# EAGLE schematic External Diagram v2 (EAGLE 8.2.1)
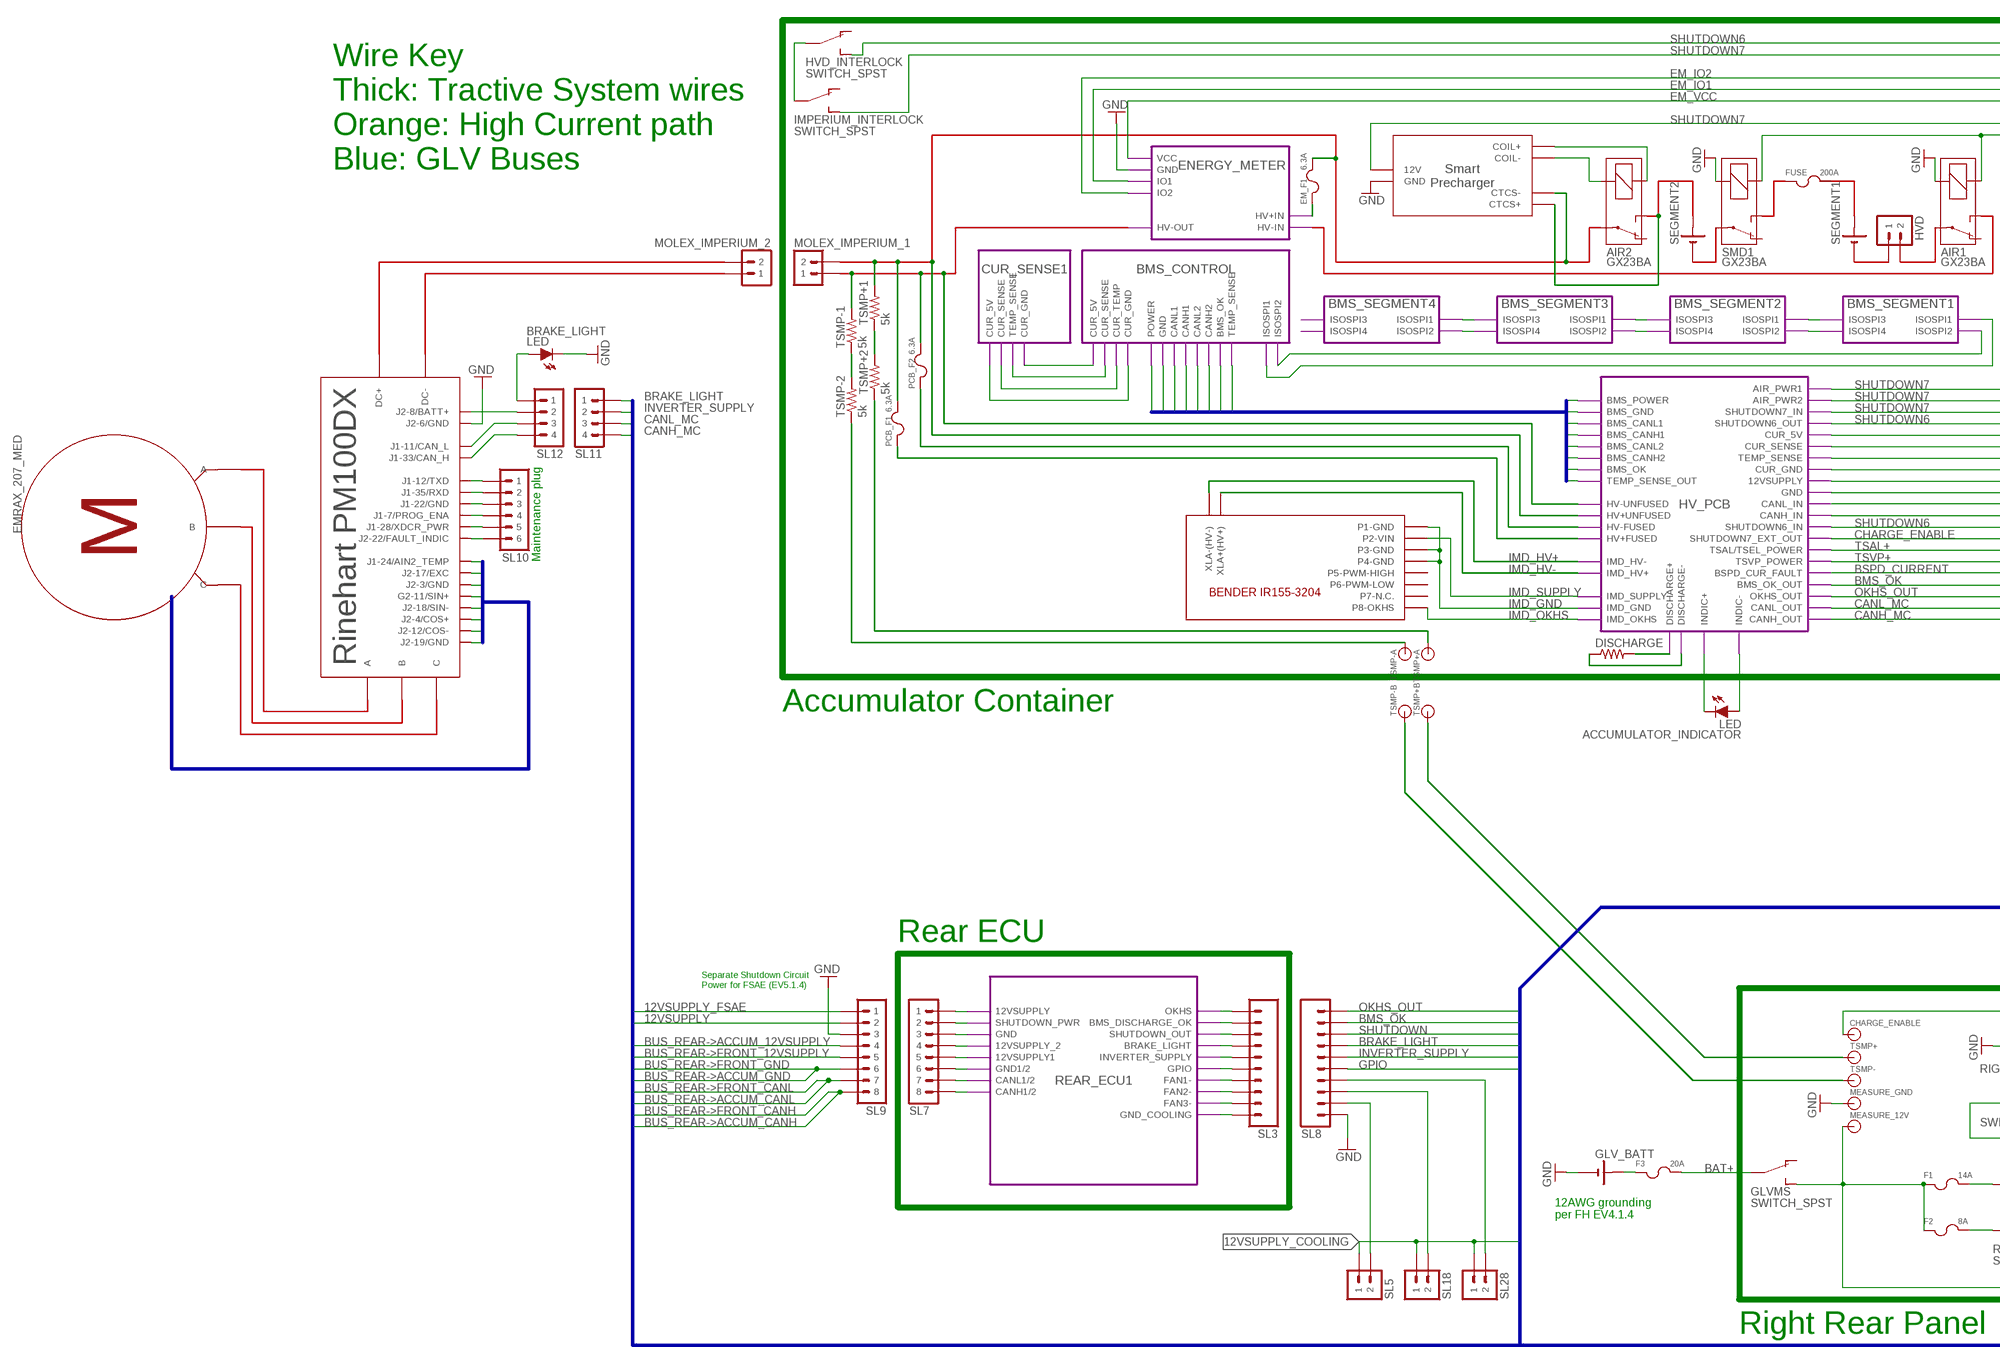
[diagram p0: schematic, sheet 1, part 1 of 2]
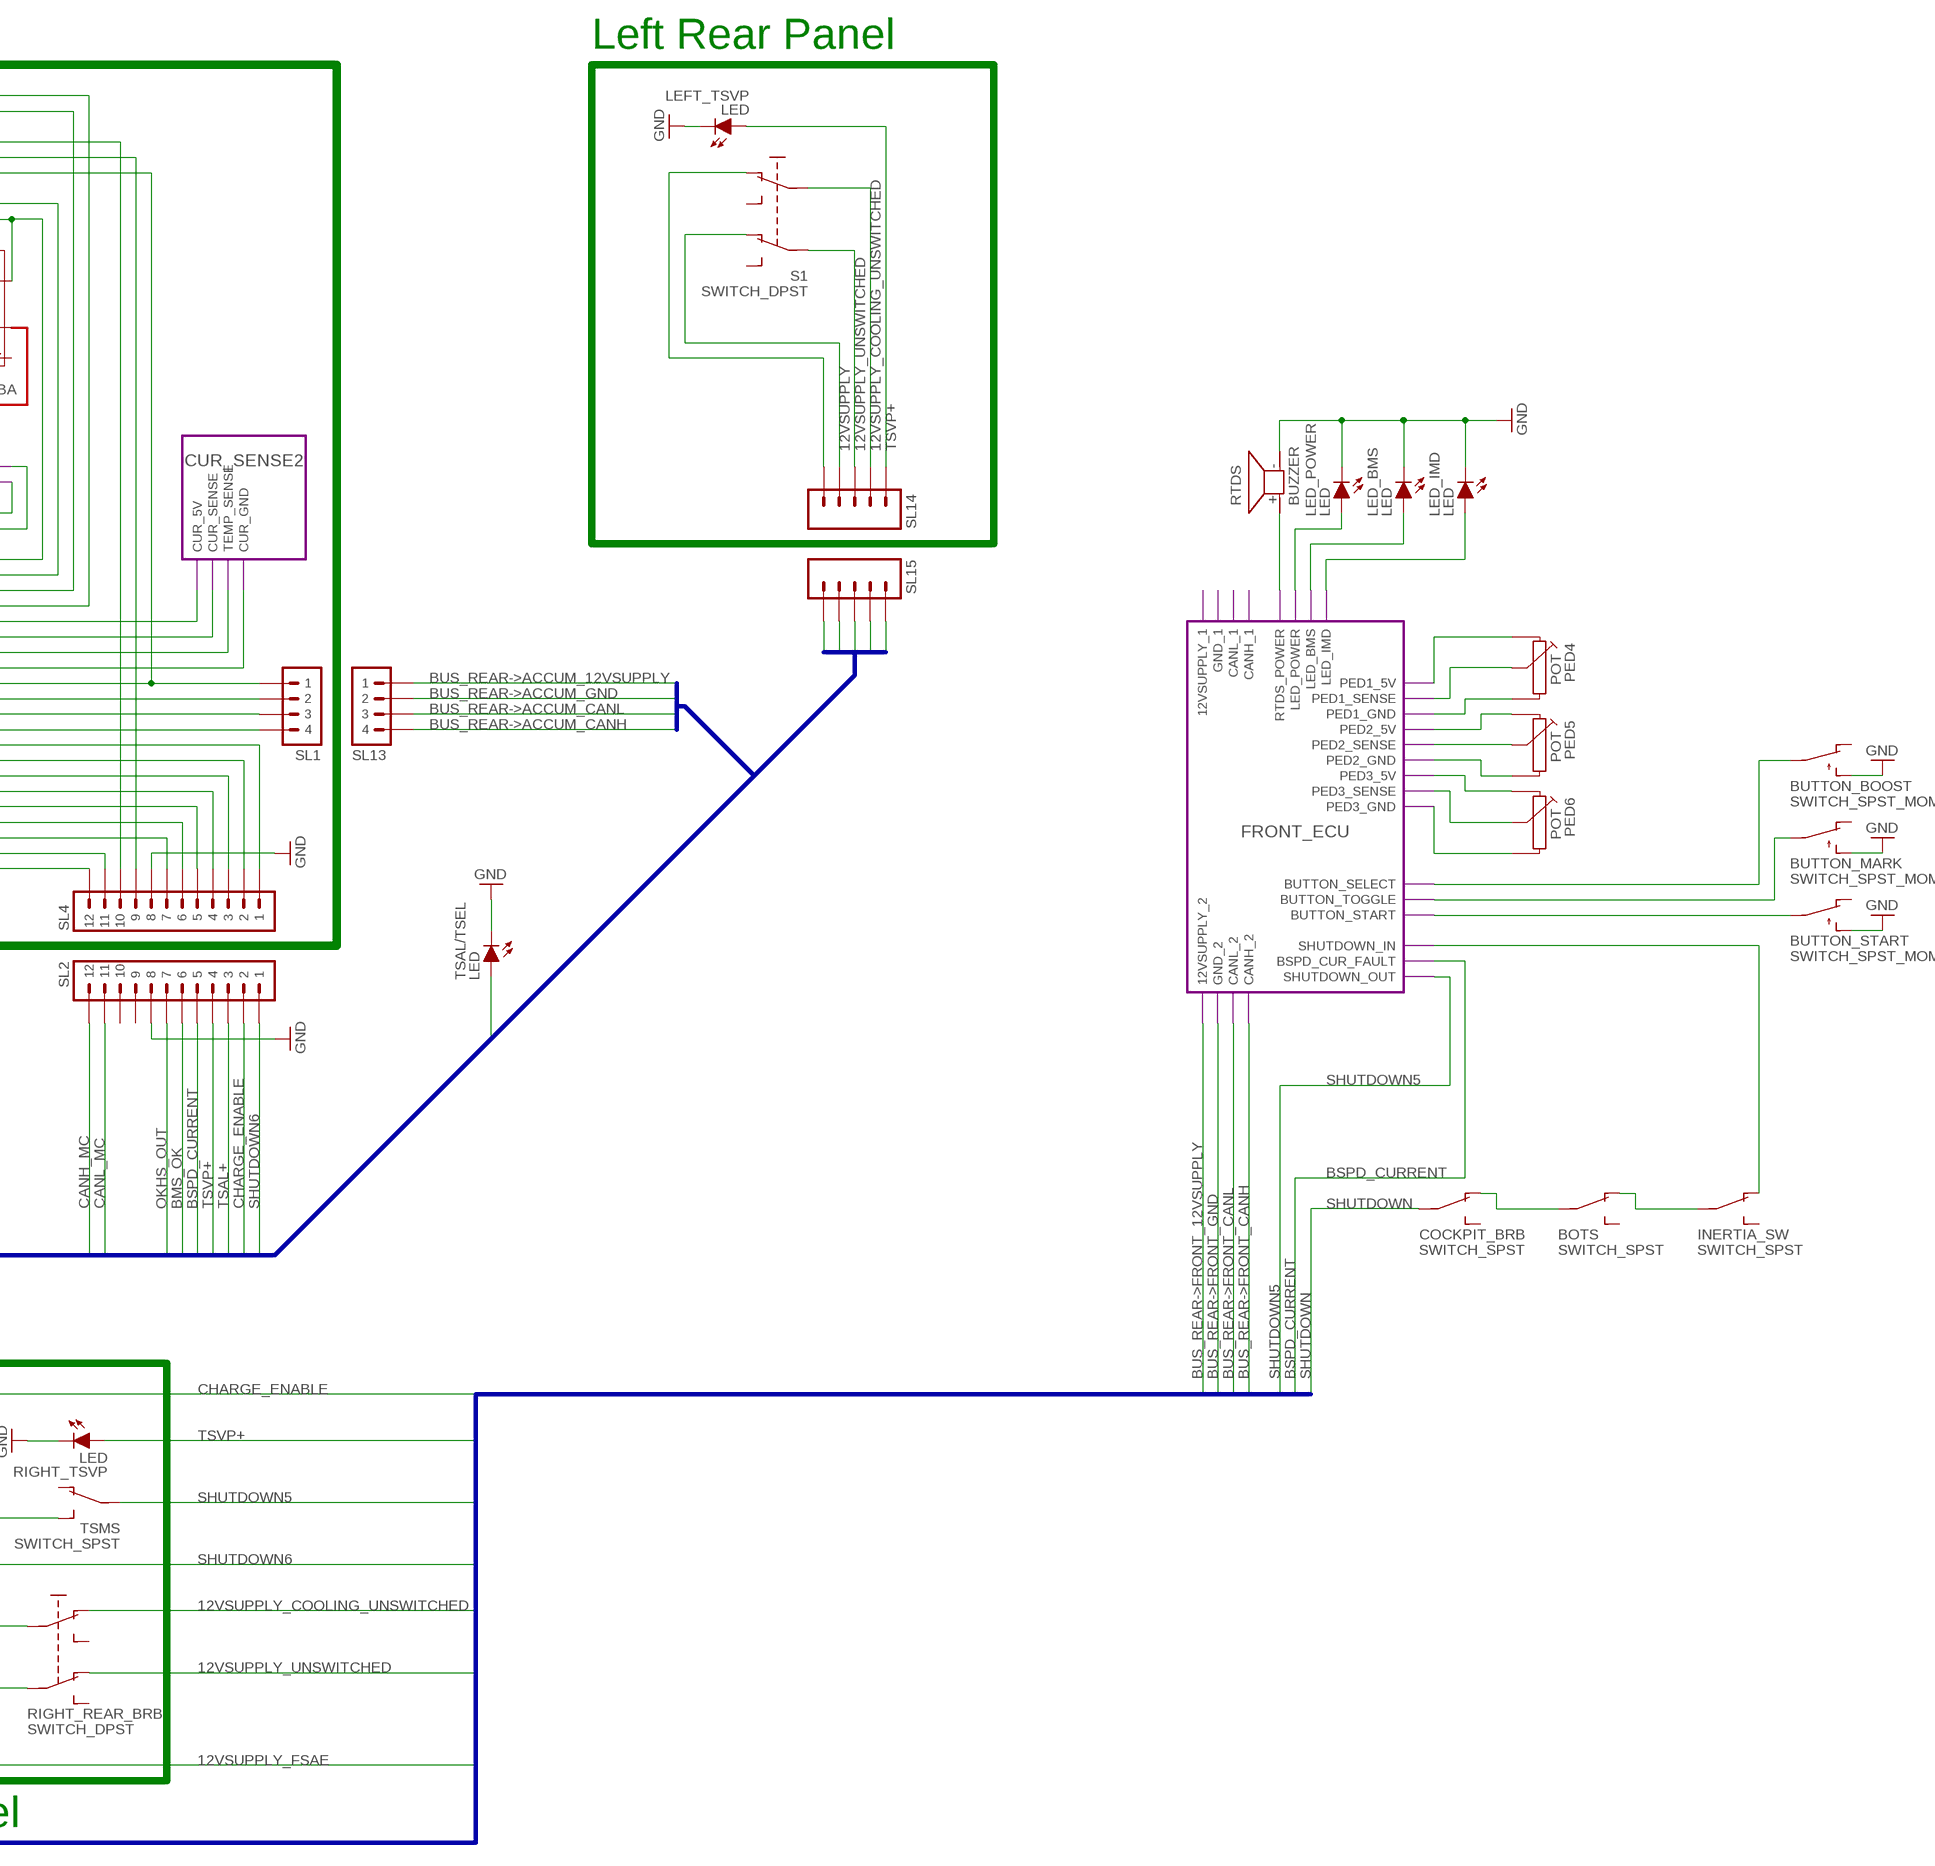
[diagram p1: schematic, sheet 1, part 2 of 2]

## Parts
ACCUMULATOR_INDICATOR  LED  (no package)
AIR1  GX23BA  RELAY  (no package)
AIR2  GX23BA  RELAY  (no package)
BOTS  SWITCH_SPST  (no package)
BRAKE_LIGHT  LED  (no package)
BUTTON_BOOST  SWITCH_SPST_MOM  (no package)
BUTTON_MARK  SWITCH_SPST_MOM  (no package)
BUTTON_START  SWITCH_SPST_MOM  (no package)
CHARGE_ENABLE  BANANA_JACK  (no package)
COCKPIT_BRB  SWITCH_SPST  (no package)
DISCHARGE  RESISTOR10W  [10W_RESISTOR_VISHAY]
EM_F1  6.3A  FUSE  (no package)
EMRAX_207_MED  MOTOR_AC  (no package)
F1  14A  FUSE  (no package)
F2  8A  FUSE  (no package)
F3  20A  FUSE  (no package)
FUSE  200A  FUSE  (no package)
GLV_BATT  BATTERY_1_CELL  (no package)
GLVMS  SWITCH_SPST  (no package)
HVD  M02  (no package)
HVD_INTERLOCK  SWITCH_SPST  (no package)
IMPERIUM_INTERLOCK  SWITCH_SPST  (no package)
INERTIA_SW  SWITCH_SPST  (no package)
LED_BMS  LED  (no package)
LED_IMD  LED  (no package)
LED_POWER  LED  (no package)
LEFT_TSVP  LED  (no package)
MEASURE_12V  BANANA_JACK  (no package)
MEASURE_GND  BANANA_JACK  (no package)
MOLEX_IMPERIUM_1  M02  (no package)
MOLEX_IMPERIUM_2  M02  (no package)
PCB_F1  6.3A  FUSE  (no package)
PCB_F2  6.3A  FUSE  (no package)
PED4  POTENTIOMETER  (no package)
PED5  POTENTIOMETER  (no package)
PED6  POTENTIOMETER  (no package)
RIGHT_REAR_BRB  SWITCH_DPST  (no package)
RIGHT_TSVP  LED  (no package)
RTDS  BUZZER  (no package)
S1  SWITCH_DPST  (no package)
SEGMENT1  BATTERY_1_CELL  (no package)
SEGMENT2  BATTERY_1_CELL  (no package)
SL1  M04  (no package)
SL2  M12  (no package)
SL3  M10  (no package)
SL4  M12  (no package)
SL5  M02  (no package)
SL7  M08  (no package)
SL8  M10  (no package)
SL9  M08  (no package)
SL10  M06  (no package)
SL11  M04  (no package)
SL12  M04  (no package)
SL13  M04  (no package)
SL14  M05  (no package)
SL15  M05  (no package)
SL18  M02  (no package)
SL28  M02  (no package)
SMD1  GX23BA  RELAY  (no package)
TSAL/TSEL  LED  (no package)
TSMP+  BANANA_JACK  (no package)
TSMP+1  5k  RESISTOR10W  [10W_RESISTOR_VISHAY]
TSMP+2  5k  RESISTOR10W  [10W_RESISTOR_VISHAY]
TSMP+A  BANANA_JACK  (no package)
TSMP+B  BANANA_JACK  (no package)
TSMP-  BANANA_JACK  (no package)
TSMP-1  5k  RESISTOR10W  [10W_RESISTOR_VISHAY]
TSMP-2  5k  RESISTOR10W  [10W_RESISTOR_VISHAY]
TSMP-A  BANANA_JACK  (no package)
TSMP-B  BANANA_JACK  (no package)
TSMS  SWITCH_SPST  (no package)
U$1  RINEHART_PM100DX  (no package)
U$2  BENDER_IR155-3204  (no package)
U$3  SMART_PRECHARGER  (no package)

## Module instances
FRONT_ECU = DASHBOARD_BOARD
HV_PCB = HV_BOARD
BMS_SEGMENT1 = BMS_SEGMENT
BMS_SEGMENT2 = BMS_SEGMENT
BMS_SEGMENT3 = BMS_SEGMENT
BMS_SEGMENT4 = BMS_SEGMENT
BMS_CONTROL = BMS_CONTROL
ENERGY_METER = ENERGY_METER
REAR_ECU1 = REAR_ECU
CUR_SENSE1 = CUR_SENSE
CUR_SENSE2 = CUR_SENSE

## Nets
12VSUPPLY: S1.O1 SL9.2 SL14.2 SL15.2
12VSUPPLY_COOLING: SL5.1 SL15.1 SL18.1 SL28.1
12VSUPPLY_COOLING_UNSWITCHED: RIGHT_REAR_BRB.O S1.P SL14.4 SL15.4
12VSUPPLY_FSAE: F1.1 F2.1 GLVMS.S MEASURE_12V.1 SL9.1
12VSUPPLY_UNSWITCHED: RIGHT_REAR_BRB.O1 S1.P1 SL14.3 SL15.3
BAT+: F3.2 GLVMS.P
BMS_CANH1: port BMS_CONTROL.CANH1 HV_PCB.BMS_CANH1
BMS_CANH2: port BMS_CONTROL.CANH2 HV_PCB.BMS_CANH2
BMS_CANL1: port BMS_CONTROL.CANL1 HV_PCB.BMS_CANL1
BMS_CANL2: port BMS_CONTROL.CANL2 HV_PCB.BMS_CANL2
BMS_GND: port BMS_CONTROL.GND HV_PCB.BMS_GND
BMS_OK: SL2.6 SL4.6 SL8.2 ; port BMS_CONTROL.BMS_OK HV_PCB.BMS_OK HV_PCB.BMS_OK_OUT
BMS_POWER: port BMS_CONTROL.POWER HV_PCB.BMS_POWER
BRAKE_LIGHT: SL8.4 SL11.1
BSPD_CURRENT: SL2.5 SL4.5 ; port FRONT_ECU.BSPD_CUR_FAULT HV_PCB.BSPD_CUR_FAULT
BUS_REAR->ACCUM_12VSUPPLY: SL9.4 SL13.1
BUS_REAR->ACCUM_CANH: SL13.4
BUS_REAR->ACCUM_CANL: SL13.3
BUS_REAR->ACCUM_GND: SL13.2
BUS_REAR->FRONT_12VSUPPLY: SL9.5 ; port FRONT_ECU.12VSUPPLY_2
BUS_REAR->FRONT_CANH: SL9.8 ; port FRONT_ECU.CANH_2
BUS_REAR->FRONT_CANL: SL9.7 ; port FRONT_ECU.CANL_2
BUS_REAR->FRONT_GND: SL9.6 ; port FRONT_ECU.GND_2
CANH_MC: SL2.12 SL4.12 SL11.4 ; port HV_PCB.CANH_OUT
CANH_OUT: SL12.3 U$1.J1-11/CAN_L
CANL_MC: SL2.11 SL4.11 SL11.3 ; port HV_PCB.CANL_OUT
CANL_OUT: SL12.4 U$1.J1-33/CAN_H
CHARGE_ENABLE: CHARGE_ENABLE.1 SL2.2 SL4.2 ; port HV_PCB.SHUTDOWN7_EXT_OUT
COS+: U$1.J2-4/COS+
COS-: U$1.J2-12/COS-
EM_IO1: SL4.9 ; port ENERGY_METER.IO1
EM_IO2: SL4.10 ; port ENERGY_METER.IO2
EM_VCC: SL1.1 ; port ENERGY_METER.VCC HV_PCB.12VSUPPLY
EXC+: U$1.J2-17/EXC
EXC-: U$1.J2-3/GND
GND: AIR1.2 BRAKE_LIGHT.C BUTTON_BOOST.S BUTTON_MARK.S BUTTON_START.S GLV_BATT.- LED_BMS.C LED_IMD.C LED_POWER.C LEFT_TSVP.C MEASURE_GND.1 RIGHT_TSVP.C RTDS.2 SL2.8 SL4.8 SL8.10 SL9.3 SMD1.2 TSAL/TSEL.C U$1.J2-6/GND U$1.J2-19/GND U$3.GND ; port ENERGY_METER.GND
GPIO: SL8.6
IMD_GND: U$2.P1-GND U$2.P3-GND U$2.P4-GND ; port HV_PCB.IMD_GND
IMD_HV+: U$2.XLA-(HV-) ; port HV_PCB.IMD_HV-
IMD_HV-: U$2.XLA+(HV+) ; port HV_PCB.IMD_HV+
IMD_OKHS: U$2.P8-OKHS ; port HV_PCB.IMD_OKHS
IMD_SUPPLY: U$2.P2-VIN ; port HV_PCB.IMD_SUPPLY
INVERTER_SUPPLY: SL8.5 SL11.2 SL12.2 U$1.J2-8/BATT+
MOTOR_TEMP: U$1.J1-24/AIN2_TEMP
N$1: RTDS.1 ; port FRONT_ECU.RTDS_POWER
N$2: LED_POWER.A ; port FRONT_ECU.LED_POWER
N$3: TSMP-.1 TSMP-B.1
N$4: BRAKE_LIGHT.A SL12.1
N$5: EM_F1.1 ; port ENERGY_METER.HV+IN
N$6: EM_F1.2
N$7: port BMS_CONTROL.CUR_GND CUR_SENSE1.CUR_5V
N$8: S1.O SL14.1
N$9: port BMS_CONTROL.CUR_TEMP CUR_SENSE1.CUR_SENSE
N$10: port BMS_CONTROL.CUR_SENSE CUR_SENSE1.TEMP_SENSE
N$11: port BMS_CONTROL.CUR_5V CUR_SENSE1.CUR_GND
N$12: port HV_PCB.HV+UNFUSED
N$15: TSMP+.1 TSMP+B.1
N$16: F1.2 RIGHT_REAR_BRB.P
N$17: F2.2 RIGHT_REAR_BRB.P1
N$18: port HV_PCB.HV-UNFUSED
N$19: SL3.1 ; port REAR_ECU1.OKHS
N$20: TSMP-2.1 TSMP-A.1
N$21: SL3.2 ; port REAR_ECU1.BMS_DISCHARGE_OK
N$22: ACCUMULATOR_INDICATOR.A ; port HV_PCB.INDIC-
N$23: SL3.3 ; port REAR_ECU1.SHUTDOWN_OUT
N$24: DISCHARGE.1 ; port HV_PCB.DISCHARGE-
N$25: DISCHARGE.2 ; port HV_PCB.DISCHARGE+
N$26: PED4.1A ; port FRONT_ECU.PED1_5V
N$27: SL3.4 ; port REAR_ECU1.BRAKE_LIGHT
N$28: SL3.5 ; port REAR_ECU1.INVERTER_SUPPLY
N$29: SL3.6 ; port REAR_ECU1.GPIO
N$30: SL3.7 ; port REAR_ECU1.FAN1-
N$31: SL3.8 ; port REAR_ECU1.FAN2-
N$32: SL10.1 U$1.J1-12/TXD
N$34: TSMP+2.1 TSMP+A.1
N$35: SL3.9 ; port REAR_ECU1.FAN3-
N$36: SL3.10 ; port REAR_ECU1.GND_COOLING
N$37: TSMP-1.1 TSMP-2.2
N$38: TSMP+1.1 TSMP+2.2
N$39: TSMP-1.2
N$40: TSMP+1.2
N$41: SL7.1 ; port REAR_ECU1.12VSUPPLY
N$42: U$3.CTCS-
N$43: SL10.2 U$1.J1-35/RXD
N$44: port BMS_SEGMENT3.ISOSPI3 BMS_SEGMENT4.ISOSPI1
N$45: AIR2.2 U$3.COIL-
N$46: PCB_F1.1 ; port HV_PCB.HV+FUSED
N$47: BUTTON_START.P ; port FRONT_ECU.BUTTON_START
N$48: BUTTON_MARK.P ; port FRONT_ECU.BUTTON_TOGGLE
N$49: PCB_F2.1 ; port HV_PCB.HV-FUSED
N$50: BUTTON_BOOST.P ; port FRONT_ECU.BUTTON_SELECT
N$51: PCB_F1.2
N$52: PCB_F2.2
N$53: port BMS_SEGMENT3.ISOSPI4 BMS_SEGMENT4.ISOSPI2
N$54: AIR2.1 U$3.COIL+
N$55: port BMS_SEGMENT2.ISOSPI3 BMS_SEGMENT3.ISOSPI1
N$56: port BMS_SEGMENT2.ISOSPI4 BMS_SEGMENT3.ISOSPI2
N$57: port BMS_SEGMENT1.ISOSPI3 BMS_SEGMENT2.ISOSPI1
N$58: port BMS_SEGMENT1.ISOSPI4 BMS_SEGMENT2.ISOSPI2
N$60: U$3.CTCS+
N$61: HVD_INTERLOCK.P IMPERIUM_INTERLOCK.P
N$63: SL10.3 U$1.J1-22/GND
N$64: SL7.2 ; port REAR_ECU1.SHUTDOWN_PWR
N$65: SL7.3 ; port REAR_ECU1.GND
N$66: SL7.4 ; port REAR_ECU1.12VSUPPLY_2
N$67: ACCUMULATOR_INDICATOR.C ; port HV_PCB.INDIC+
N$68: F3.1 GLV_BATT.+
N$69: SL10.4 U$1.J1-7/PROG_ENA
N$70: port BMS_SEGMENT1.ISOSPI2 BMS_CONTROL.ISOSPI2
N$71: SL10.5 U$1.J1-28/XDCR_PWR
N$72: SL10.6 U$1.J2-22/FAULT_INDIC
N$73: SL7.5 ; port REAR_ECU1.12VSUPPLY1
N$74: port BMS_SEGMENT1.ISOSPI1 BMS_CONTROL.ISOSPI1
N$75: LED_BMS.A ; port FRONT_ECU.LED_BMS
N$76: SL7.6 ; port REAR_ECU1.GND1/2
N$77: SL7.7 ; port REAR_ECU1.CANL1/2
N$78: SL7.8 ; port REAR_ECU1.CANH1/2
N$79: SL5.2 SL8.9
N$80: SL1.2 ; port HV_PCB.GND
N$81: SL1.3 ; port HV_PCB.CANL_IN
N$82: SL1.4 ; port HV_PCB.CANH_IN
N$83: PED4.1S ; port FRONT_ECU.PED1_SENSE
N$84: PED4.1E ; port FRONT_ECU.PED1_GND
N$86: PED5.1A ; port FRONT_ECU.PED2_5V
N$87: PED5.1S ; port FRONT_ECU.PED2_SENSE
N$88: PED5.1E ; port FRONT_ECU.PED2_GND
N$89: PED6.1A ; port FRONT_ECU.PED3_5V
N$90: PED6.1S ; port FRONT_ECU.PED3_SENSE
N$91: LED_IMD.A ; port FRONT_ECU.LED_IMD
N$93: PED6.1E ; port FRONT_ECU.PED3_GND
N$94: SL8.8 SL18.2
N$95: SL8.7 SL28.2
N$96: port HV_PCB.CUR_GND CUR_SENSE2.CUR_GND
N$97: port HV_PCB.TEMP_SENSE CUR_SENSE2.TEMP_SENSE
N$98: port HV_PCB.CUR_SENSE CUR_SENSE2.CUR_SENSE
N$99: port HV_PCB.CUR_5V CUR_SENSE2.CUR_5V
OKHS_OUT: SL2.7 SL4.7 SL8.1 ; port HV_PCB.OKHS_OUT
SHUTDOWN: COCKPIT_BRB.P SL8.3
SHUTDOWN2: BOTS.P COCKPIT_BRB.O
SHUTDOWN3: BOTS.O INERTIA_SW.P
SHUTDOWN4: INERTIA_SW.O ; port FRONT_ECU.SHUTDOWN_IN
SHUTDOWN5: TSMS.P ; port FRONT_ECU.SHUTDOWN_OUT
SHUTDOWN6: HVD_INTERLOCK.S SL2.1 SL4.1 TSMS.S ; port HV_PCB.SHUTDOWN6_OUT HV_PCB.SHUTDOWN6_IN
SHUTDOWN7: AIR1.1 IMPERIUM_INTERLOCK.S SMD1.1 U$3.12V ; port HV_PCB.SHUTDOWN7_IN HV_PCB.AIR_PWR2 HV_PCB.AIR_PWR1
SIN+: U$1.G2-11/SIN+
SIN-: U$1.J2-18/SIN-
TEMP_SENSE: port HV_PCB.TEMP_SENSE_OUT BMS_CONTROL.TEMP_SENSE
TSAL+: SL2.3 SL4.3 TSAL/TSEL.A ; port HV_PCB.TSAL/TSEL_POWER
TSVP+: LEFT_TSVP.A RIGHT_TSVP.A SL2.4 SL4.4 SL14.5 SL15.5 ; port HV_PCB.TSVP_POWER
Unconnected: AIR1.O AIR1.P AIR1.S AIR2.O AIR2.P AIR2.S BOTS.S BUTTON_BOOST.O BUTTON_MARK.O BUTTON_START.O COCKPIT_BRB.S EMRAX_207_MED.A EMRAX_207_MED.B EMRAX_207_MED.C FUSE.1 FUSE.2 GLVMS.O HVD.1 HVD.2 HVD_INTERLOCK.O IMPERIUM_INTERLOCK.O INERTIA_SW.S MOLEX_IMPERIUM_1.1 MOLEX_IMPERIUM_1.2 MOLEX_IMPERIUM_2.1 MOLEX_IMPERIUM_2.2 RIGHT_REAR_BRB.S RIGHT_REAR_BRB.S1 S1.S S1.S1 SEGMENT1.+ SEGMENT1.- SEGMENT2.+ SEGMENT2.- SL2.9 SL2.10 SMD1.O SMD1.P SMD1.S TSMS.O U$1.A U$1.B U$1.C U$1.DC+ U$1.DC- U$2.P5-PWM-HIGH U$2.P6-PWM-LOW U$2.P7-N.C.

## Buses
MOTOR_TEMP,EXC+,EXC-,SIN+,SIN-,COS+,COS-,GND
12VSUPPLY,12VSUPPLY_COOLING,12VSUPPLY_COOLING_UNSWITCHED,12VSUPPLY_UNSWITCHED,12VSUPPLY_FSAE,BAT+,BRAKE_LIGHT,BSPD_CURRENT,BMS_OK,BUS_REAR->ACCUM_12VSUPPLY,BUS_REAR->ACCUM_CANL,BUS_REAR->ACCUM_CANH,BUS_REAR->ACCUM_GND,BUS_REAR->FRONT_12VSUPPLY,BUS_REAR->FRONT_CANL,BUS_REAR->FRONT_CANH,BUS_REAR->FRONT_GND,CANL_MC,CANH_MC,CHARGE_ENABLE,GPIO,INVERTER_SUPPLY,OKHS_OUT,SHUTDOWN1,SHUTDOWN5,SHUTDOWN6,TSAL+,TSVP+
BMS_POWER,BMS_GND,BMS_CANL1,BMS_CANH1,BMS_CANL2,BMS_CANH2,BMS_OK,TEMP_SENSE

## Notes on the sheet
- Left Rear Panel
- Wire Key
  Thick: Tractive System wires
  Orange: High Current path
  Blue: GLV Buses
- Maintenance plug
- Accumulator Container
- Rear ECU
- Separate Shutdown Circuit
  Power for FSAE (EV5.1.4)
- 12AWG grounding
  per FH EV4.1.4
- Right Rear Panel

## Library data of the parts
ACCUMULATOR_INDICATOR BRAKE_LIGHT LED_BMS LED_IMD LED_POWER LEFT_TSVP RIGHT_TSVP TSAL/TSEL = HyTechSymbols:LED: Generic LED
AIR1 AIR2 SMD1 = HyTechSymbols:RELAY: RELAY 1 x switch
BOTS COCKPIT_BRB GLVMS HVD_INTERLOCK IMPERIUM_INTERLOCK INERTIA_SW TSMS = HyTechSymbols:SWITCH_SPST: Single Pull Single Throw Switch
BUTTON_BOOST BUTTON_MARK BUTTON_START = HyTechSymbols:SWITCH_SPST_MOM: Single Pull Single Throw Switch Momentary
CHARGE_ENABLE MEASURE_12V MEASURE_GND TSMP+ TSMP+A TSMP+B TSMP- TSMP-A TSMP-B = HyTechSymbols:BANANA_JACK: Banana Jack Purchasing: Mouser - Red <http://www.mouser.com/ProductDetail/Pomona-Electronics/72930-2/?qs=2nDnb8a6ouM2t6dPw1JBow%3D%3D> Mouser - Black <http://www.mouser.com/ProductDetail/Pomona-Electronics/72930-0/?qs=2nDnb8a6ouNpA2wl9kKnzA%3D%3D>
DISCHARGE TSMP+1 TSMP+2 TSMP-1 TSMP-2 = HyTechDevices:RESISTOR: Resistor Basic schematic elements and footprints for 0603, 1206, and PTH resistors.
EM_F1 F1-F3 FUSE PCB_F1 PCB_F2 = HyTechSymbols:FUSE: Generic Fuse
EMRAX_207_MED = HyTechSymbols:MOTOR_AC: Generic three-phase AC electric motor
GLV_BATT SEGMENT1 SEGMENT2 = HyTechSymbols:BATTERY_1_CELL: Generic 1-cell battery Source: Sonnenschein
HVD MOLEX_IMPERIUM_1 MOLEX_IMPERIUM_2 SL5 SL18 SL28 = HyTechSymbols:M02: Generic 2-pin connector
PED4-PED6 = HyTechSymbols:POTENTIOMETER: Generic potentiometer
RIGHT_REAR_BRB S1 = HyTechSymbols:SWITCH_DPST: Double Pull Single Throw Switch
RTDS = HyTechSymbols:BUZZER: SPEAKER Prouct Page <http://www.alliedelec.com/icc-intervox-brp4535s-12-c/70115826/> (Ready to Drive Sound) Source: Schukat
SL1 SL11-SL13 = HyTechSymbols:M04: Generic 4-pin connector
SL2 SL4 = HyTechSymbols:M12: Generic 12-pin connector
SL3 SL8 = HyTechSymbols:M10: Generic 10-pin connector
SL7 SL9 = HyTechSymbols:M08: Generic 8-pin connector
SL10 = HyTechSymbols:M06: Generic 6-pin connector
SL14 SL15 = HyTechSymbols:M05: Generic 5-pin connector
U$1 = HyTechSymbols:RINEHART_PM100DX: Rinehart Motion Systems PM100DX Motor Inverter Product Page <http://www.rinehartmotion.com/standard.html> Datasheet <http://www.rinehartmotion.com/uploads/5/1/3/0/51309945/pm100-150datasheet_2.pdf>
U$2 = HyTechSymbols:BENDER_IR155-3204: Bender IR155-3204 Insulation Monitoring Device Datasheet <http://www.bender-es.com/fileadmin/products/doc/IR155-32xx-V004_D00115_D_XXEN.pdf>
U$3 = HyTechSymbols:SMART_PRECHARGER: Smart Precharger http://www.zeva.com.au/Products/datasheets/SmartPrechargerV1-3.pdf

## Module PEDAL_BOX_BOARD
Ports: 12VSUPPLY_1(in) CANL_1(io) CANH_1(io) CANH_2(io) CANL_2(io) 12VSUPPLY_2(out) SHUTDOWN_OUT(out) SHUTDOWN_IN(in) PED1_5V(out) PED2_5V(out) PED3_5V(out) PED1_SENSE(in) PED1_GND(in) PED2_SENSE(in) PED2_GND(in) PED3_SENSE(in) PED3_GND(in) GND_1(out) GND_2(in) BSPD_CUR_FAULT(in)

### Library data of the parts

## Module WHEEL_TELEMETRY_BOARD
Ports: 12VSUPPLY_1(in) GND_2(in) 12VSUPPLY_2(out) GND_1(out) CANL_2(io) CANH_2(io) CANL_1(io) CANH_1(io) WHEEL_SPEED_5V(out) WHEEL_TEMP_5V(out) WHEEL_SPEED_SENSE(in) WHEEL_SPEED_GND(in) WHEEL_TEMP_SENSE(in) WHEEL_TEMP_GND(in) SUSPENSION_GND(in) SUSPENSION_5V(out) SUSPENSION_SENSE(in)

### Library data of the parts

## Module DASHBOARD_BOARD
Ports: CANL_1(io) CANL_2(io) CANH_2(io) CANH_1(io) RTDS_POWER(out) BUTTON_START(in) BUTTON_TOGGLE(in) BUTTON_SELECT(in) GND_1(in) 12VSUPPLY_1(out) GND_2(out) 12VSUPPLY_2(in) LED_POWER(out) LED_BMS(out) LED_IMD(out) PED1_5V(out) PED2_5V(out) PED3_5V(out) PED1_SENSE(in) PED2_SENSE(in) PED3_SENSE(in) PED1_GND(in) PED2_GND(in) PED3_GND(in) SHUTDOWN_IN(in) BSPD_CUR_FAULT(in) SHUTDOWN_OUT(out)

### Library data of the parts

## Module POWER_BOARD
Ports: SHUTDOWN_OUT(out) BRAKE_LIGHT(out) GND_2(in) 12VSUPPLY_2(out) 12VSUPPLY_1(out) GND_1(in) CANH_1(io) CANL_1(io) CANL_2(io) CANH_2(io) 12VSUPPLY(in) OKHS(in) GND(out) INVERTER_SUPPLY(out) GPIO1(io) BMS_DISCHARGE_OK(in) SHUTDOWN_PWR(in) GND2(out)

### Library data of the parts

## Module COOLING_BOARD
Ports: 12VSUPPLY_1(in) GND_1(out) 12VSUPPLY_2(out) GND_2(in) CANL_1(io) CANH_1(io) CANL_2(io) CANH_2(io) FLOW_METER_5V(out) FLOW_METER_SENSE(in) FLOW_METER_GND(in) FAN1-(in) FAN2-(in) PUMP-(in) FAN1_GND(out) FAN2_GND(out) PUMP_GND(out)

### Library data of the parts

## Module HV_BOARD
Ports: TSVP_POWER(out) GND(in) TSAL/TSEL_POWER(out) CUR_SENSE(in) CUR_GND(in) CUR_5V(out) BSPD_CUR_FAULT(out) IMD_SUPPLY(out) IMD_GND(in) IMD_HV+(nc) IMD_HV-(nc) BMS_POWER(out) BMS_GND(in) BMS_OK(in) BMS_CANH2(io) BMS_CANL2(io) BMS_CANL1(io) BMS_CANH1(io) HV+UNFUSED(in) HV-UNFUSED(out) 12VSUPPLY(in) CANH_IN(io) CANL_IN(io) CANH_OUT(io) CANL_OUT(io) BMS_OK_OUT(out) HV+FUSED(in) HV-FUSED(out) AIR_PWR1(out) AIR_PWR2(out) SHUTDOWN6_IN(in) SHUTDOWN6_OUT(out) SHUTDOWN7_IN(in) IMD_OKHS(in) OKHS_OUT(out) SHUTDOWN7_EXT_OUT(out) TEMP_SENSE(in) TEMP_SENSE_OUT(out) INDIC+(out) INDIC-(in) DISCHARGE+(out) DISCHARGE-(in)

### Library data of the parts

## Module SAMSUNG_GALAXY
Ports: 

### Library data of the parts

## Module CUTOFF
Ports: OUT(out) GND(out) IN(in)

### Library data of the parts

## Module RASPBERRY_PI
Ports: 5V(in) GND(out) SI(io) SO(io) SCK(io) CS(io)

### Library data of the parts

## Module STEERING_WHEEL_BOARD
Ports: CANL(io) CANH(io) 12VSUPPLY(in) GND(out) PI_5VSUPPLY(out) PI_GND(in) PI_SI(io) PI_SO(io) PI_SCK(io) PI_CS(io) BUTTON_MAR(in) BUTTON_BOOST(in)

### Library data of the parts

## Module BMS_SEGMENT
Ports: ISOSPI1(io) ISOSPI2(io) ISOSPI3(io) ISOSPI4(io)

### Library data of the parts

## Module BMS_CONTROL
Ports: ISOSPI1(io) ISOSPI2(io) POWER(in) GND(out) BMS_OK(out) CANL1(io) CANH1(io) CANL2(io) CANH2(io) TEMP_SENSE(in) CUR_SENSE(in) CUR_TEMP(in) CUR_GND(in) CUR_5V(out)

### Library data of the parts

## Module ENERGY_METER
Ports: HV+IN(in) HV-OUT(in) HV-IN(out) VCC(in) GND(out) IO1(io) IO2(io)

### Library data of the parts

## Module REAR_ECU
Ports: 12VSUPPLY(in) SHUTDOWN_PWR(in) GND(out) 12VSUPPLY_2(out) 12VSUPPLY1(out) GND1/2(in) CANL1/2(io) CANH1/2(io) OKHS(in) BMS_DISCHARGE_OK(in) SHUTDOWN_OUT(out) BRAKE_LIGHT(out) INVERTER_SUPPLY(out) GPIO(io) FAN1-(in) FAN2-(in) FAN3-(in) GND_COOLING(out)

### Library data of the parts

## Module CUR_SENSE
Ports: CUR_GND(out) CUR_SENSE(out) TEMP_SENSE(out) CUR_5V(in)

### Library data of the parts